# Altium schematic sheet OUT.SchDoc
size A
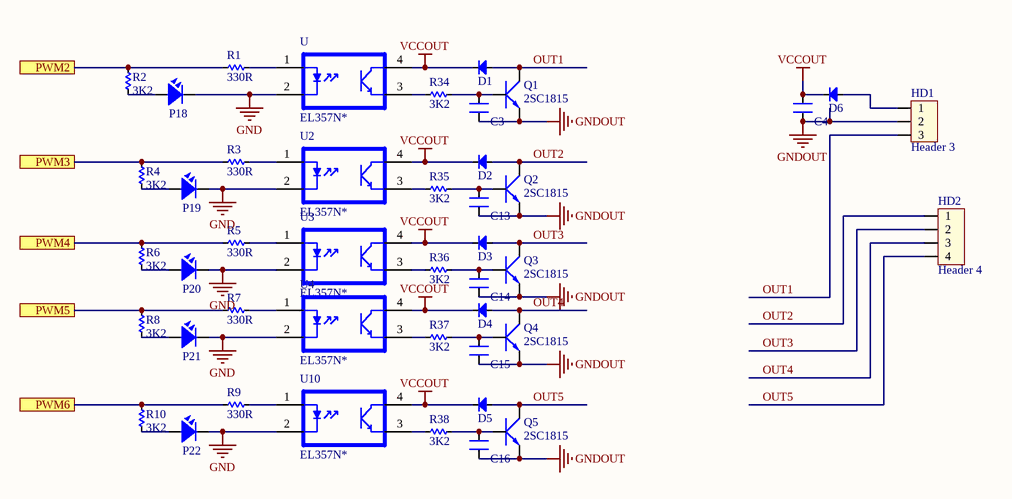
[diagram p0: OUT.SchDoc]

## Parts
C3  100nF  [CN-SMD-0805]  (value not drawn)
C4  100nF  [CN-SMD-0805]  (value not drawn)
C13  100nF  [CN-SMD-0805]  (value not drawn)
C14  100nF  [CN-SMD-0805]  (value not drawn)
C15  100nF  [CN-SMD-0805]  (value not drawn)
C16  100nF  [CN-SMD-0805]  (value not drawn)
D1  Diode  [DIO-SMD-123]  (value not drawn)
D2  Diode  [DIO-SMD-123]  (value not drawn)
D3  Diode  [DIO-SMD-123]  (value not drawn)
D4  Diode  [DIO-SMD-123]  (value not drawn)
D5  Diode  [DIO-SMD-123]  (value not drawn)
D6  Diode  [DIO-SMD-123]  (value not drawn)
HD1  Header 3  [HED3T]
HD2  Header 4  [HED4T]
P18  LED  [LED-0805-Green]  (value not drawn)
P19  LED  [LED-0805-Green]  (value not drawn)
P20  LED  [LED-0805-Green]  (value not drawn)
P21  LED  [LED-0805-Green]  (value not drawn)
P22  LED  [LED-0805-Green]  (value not drawn)
Q1  2SC1815  [SOT23-321]
Q2  2SC1815  [SOT23-321]
Q3  2SC1815  [SOT23-321]
Q4  2SC1815  [SOT23-321]
Q5  2SC1815  [SOT23-321]
R1  330R  [RES-SMD-0805]
R2  3K2  [RES-SMD-0805]
R3  330R  [RES-SMD-0805]
R4  3K2  [RES-SMD-0805]
R5  330R  [RES-SMD-0805]
R6  3K2  [RES-SMD-0805]
R7  330R  [RES-SMD-0805]
R8  3K2  [RES-SMD-0805]
R9  330R  [RES-SMD-0805]
R10  3K2  [RES-SMD-0805]
R34  3K2  [RES-SMD-0805]
R35  3K2  [RES-SMD-0805]
R36  3K2  [RES-SMD-0805]
R37  3K2  [RES-SMD-0805]
R38  3K2  [RES-SMD-0805]
U  EL357N*  [SOP4N]
U2  EL357N*  [SOP4N]
U3  EL357N*  [SOP4N]
U4  EL357N*  [SOP4N]
U10  EL357N*  [SOP4N]

## Ports
PWM2, PWM3, PWM4, PWM5, PWM6

## Nets
GND: P18.2 P19.2 P20.2 P21.2 P22.2 U.2(K) U2.2(K) U3.2(K) U4.2(K) U10.2(K)
GNDOUT: C3.2 C4.2 C13.2 C14.2 C15.2 C16.2 HD1.2 Q1.1(E) Q2.1(E) Q3.1(E) Q4.1(E) Q5.1(E)
VCCOUT: C4.1 D1.2(K) D2.2(K) D3.2(K) D4.2(K) D5.2(K) D6.2(K) U.4(C) U2.4(C) U3.4(C) U4.4(C) U10.4(C)
OUT1: D1.1(A) HD1.3 Q1.2(C)
OUT2: D2.1(A) HD2.1 Q2.2(C)
OUT3: D3.1(A) HD2.2 Q3.2(C)
OUT4: D4.1(A) HD2.3 Q4.2(C)
OUT5: D5.1(A) HD2.4 Q5.2(C)
PWM2: R1.1 R2.1 ; port PWM2
PWM3: R3.1 R4.1 ; port PWM3
PWM4: R5.1 R6.1 ; port PWM4
PWM5: R7.1 R8.1 ; port PWM5
PWM6: R9.1 R10.1 ; port PWM6
NetC3_1: C3.1 Q1.3(B) R34.2
NetC13_1: C13.1 Q2.3(B) R35.2
NetC14_1: C14.1 Q3.3(B) R36.2
NetC15_1: C15.1 Q4.3(B) R37.2
NetC16_1: C16.1 Q5.3(B) R38.2
NetD6_1: D6.1(A) HD1.1
NetP18_1: P18.1 R2.2
NetP19_1: P19.1 R4.2
NetP20_1: P20.1 R6.2
NetP21_1: P21.1 R8.2
NetP22_1: P22.1 R10.2
NetR1_2: R1.2 U.1(A)
NetR3_2: R3.2 U2.1(A)
NetR5_2: R5.2 U3.1(A)
NetR7_2: R7.2 U4.1(A)
NetR9_2: R9.2 U10.1(A)
NetR34_1: R34.1 U.3(E)
NetR35_1: R35.1 U2.3(E)
NetR36_1: R36.1 U3.3(E)
NetR37_1: R37.1 U4.3(E)
NetR38_1: R38.1 U10.3(E)

## Library data of the parts
C3 C4 C13-C16 = CN: Value: 33pF
D1-D6 = Diode: Default Diode; Code - JEDEC: DO-214-AB; Value: 1N5007; Published: 8-Jun-2000; Revision: July-2002: Re-released for DXP Platform.; Publisher: Altium Limited; ComponentLink1Description: ES1J - STMBL; ComponentLink1URL: https://banlinhkien.vn/goods-8089-es1j-do214-diode-1a-600v-sma-es1j-.html
HD1 = Hed3: Header 3 (Green); Value: Header 3
HD2 = Hed4: Header 4 (Green); Value: Header 4
P18-P22 = LED SMD: Value: LED 3 - 5 ly 2 Colour
Q1-Q5 = 2SC1815: NPN 600mW, ECB; Value: C1815
R1-R10 R34-R38 = R
U U2-U4 U10 = EL357N(A)(TA)-G: Optoisolator Transistor Output 3750Vrms 1 Channel 4-SOP _2.54mm_; MP: EL357N_A__TA_-G; MF: Everlight Electronics; Package: SOP-4 Everlight; Availability: Unavailable; SnapEDA_Link: https://www.snapeda.com/parts/EL357N%28A%29%28TA%29-G/Everlight%20Electronics%20Co%20Ltd/view-part/579256/?ref=snap; Price: None; Value: *